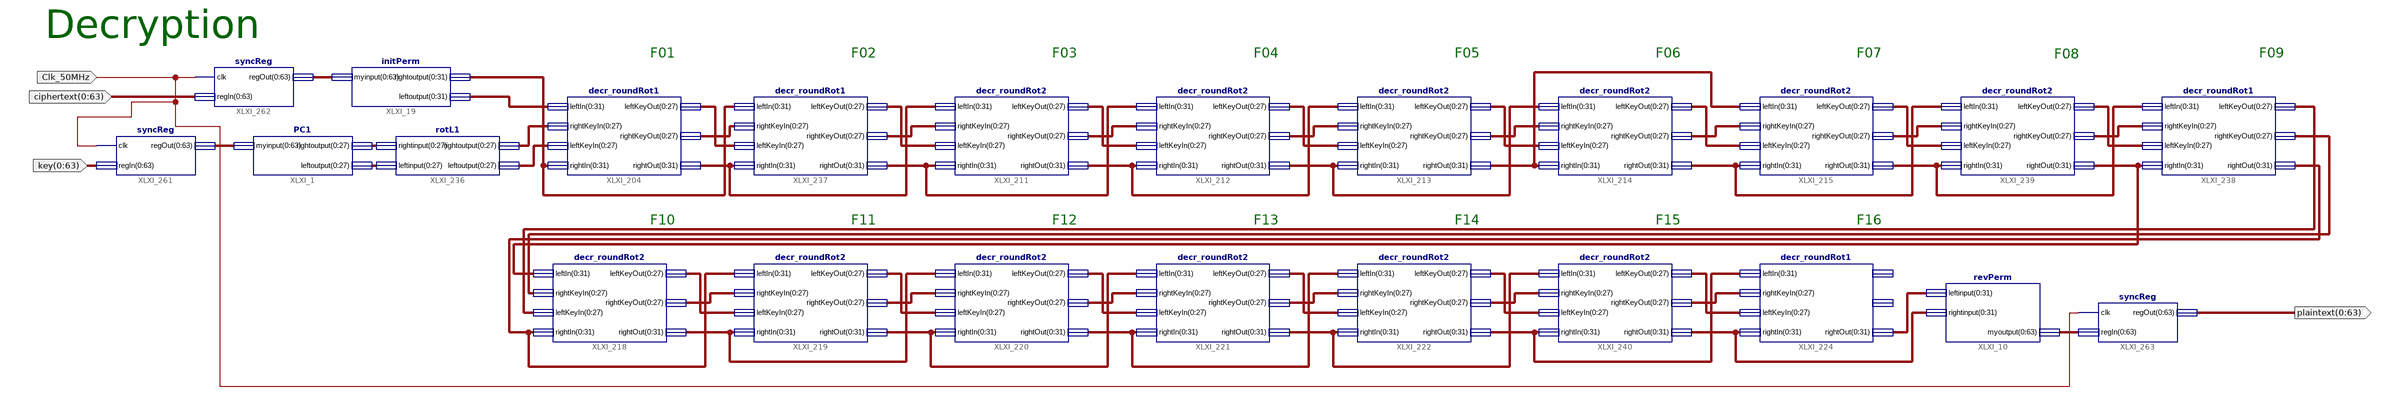
[diagram p0: schematic sheet 1]
// Xilinx ISE schematic decr_schem.sch (spartan3e) as structural Verilog: 23 symbols, 4 ports
module decr_schem (
  input  [0:63] key,
  input  Clk_50MHz,
  input  [0:63] ciphertext,
  output [0:63] plaintext
);

  wire [27:0] XLXN_502, XLXN_503, XLXN_506, XLXN_507, XLXN_509, XLXN_510, XLXN_512, XLXN_513, XLXN_515,
       XLXN_516, XLXN_518, XLXN_519, XLXN_532, XLXN_533, XLXN_536, XLXN_537, XLXN_539, XLXN_540, XLXN_542,
       XLXN_543, XLXN_546, XLXN_547, XLXN_549, XLXN_550, XLXN_554, XLXN_555, XLXN_576, XLXN_577, XLXN_579,
       XLXN_580, XLXN_631, XLXN_632, XLXN_633, XLXN_634;
  wire [31:0] XLXN_497, XLXN_498, XLXN_501, XLXN_505, XLXN_508, XLXN_511, XLXN_514, XLXN_517, XLXN_525,
       XLXN_531, XLXN_535, XLXN_538, XLXN_541, XLXN_545, XLXN_725, XLXN_727, XLXN_736, XLXN_737;
  wire [63:0] XLXN_711, XLXN_713, XLXN_718;

  revPerm XLXI_10 (
    .leftinput({XLXN_725[0], XLXN_725[1], XLXN_725[2], XLXN_725[3], XLXN_725[4], XLXN_725[5], XLXN_725[6], XLXN_725[7], XLXN_725[8], XLXN_725[9], XLXN_725[10], XLXN_725[11], XLXN_725[12], XLXN_725[13], XLXN_725[14], XLXN_725[15], XLXN_725[16], XLXN_725[17], XLXN_725[18], XLXN_725[19], XLXN_725[20], XLXN_725[21], XLXN_725[22], XLXN_725[23], XLXN_725[24], XLXN_725[25], XLXN_725[26], XLXN_725[27], XLXN_725[28], XLXN_725[29], XLXN_725[30], XLXN_725[31]}),
    .rightinput({XLXN_727[0], XLXN_727[1], XLXN_727[2], XLXN_727[3], XLXN_727[4], XLXN_727[5], XLXN_727[6], XLXN_727[7], XLXN_727[8], XLXN_727[9], XLXN_727[10], XLXN_727[11], XLXN_727[12], XLXN_727[13], XLXN_727[14], XLXN_727[15], XLXN_727[16], XLXN_727[17], XLXN_727[18], XLXN_727[19], XLXN_727[20], XLXN_727[21], XLXN_727[22], XLXN_727[23], XLXN_727[24], XLXN_727[25], XLXN_727[26], XLXN_727[27], XLXN_727[28], XLXN_727[29], XLXN_727[30], XLXN_727[31]}),
    .myoutput({XLXN_718[0], XLXN_718[1], XLXN_718[2], XLXN_718[3], XLXN_718[4], XLXN_718[5], XLXN_718[6], XLXN_718[7], XLXN_718[8], XLXN_718[9], XLXN_718[10], XLXN_718[11], XLXN_718[12], XLXN_718[13], XLXN_718[14], XLXN_718[15], XLXN_718[16], XLXN_718[17], XLXN_718[18], XLXN_718[19], XLXN_718[20], XLXN_718[21], XLXN_718[22], XLXN_718[23], XLXN_718[24], XLXN_718[25], XLXN_718[26], XLXN_718[27], XLXN_718[28], XLXN_718[29], XLXN_718[30], XLXN_718[31], XLXN_718[32], XLXN_718[33], XLXN_718[34], XLXN_718[35], XLXN_718[36], XLXN_718[37], XLXN_718[38], XLXN_718[39], XLXN_718[40], XLXN_718[41], XLXN_718[42], XLXN_718[43], XLXN_718[44], XLXN_718[45], XLXN_718[46], XLXN_718[47], XLXN_718[48], XLXN_718[49], XLXN_718[50], XLXN_718[51], XLXN_718[52], XLXN_718[53], XLXN_718[54], XLXN_718[55], XLXN_718[56], XLXN_718[57], XLXN_718[58], XLXN_718[59], XLXN_718[60], XLXN_718[61], XLXN_718[62], XLXN_718[63]}));
  decr_roundRot2 XLXI_211 (
    .leftIn({XLXN_497[0], XLXN_497[1], XLXN_497[2], XLXN_497[3], XLXN_497[4], XLXN_497[5], XLXN_497[6], XLXN_497[7], XLXN_497[8], XLXN_497[9], XLXN_497[10], XLXN_497[11], XLXN_497[12], XLXN_497[13], XLXN_497[14], XLXN_497[15], XLXN_497[16], XLXN_497[17], XLXN_497[18], XLXN_497[19], XLXN_497[20], XLXN_497[21], XLXN_497[22], XLXN_497[23], XLXN_497[24], XLXN_497[25], XLXN_497[26], XLXN_497[27], XLXN_497[28], XLXN_497[29], XLXN_497[30], XLXN_497[31]}),
    .rightKeyIn({XLXN_577[0], XLXN_577[1], XLXN_577[2], XLXN_577[3], XLXN_577[4], XLXN_577[5], XLXN_577[6], XLXN_577[7], XLXN_577[8], XLXN_577[9], XLXN_577[10], XLXN_577[11], XLXN_577[12], XLXN_577[13], XLXN_577[14], XLXN_577[15], XLXN_577[16], XLXN_577[17], XLXN_577[18], XLXN_577[19], XLXN_577[20], XLXN_577[21], XLXN_577[22], XLXN_577[23], XLXN_577[24], XLXN_577[25], XLXN_577[26], XLXN_577[27]}),
    .leftKeyIn({XLXN_576[0], XLXN_576[1], XLXN_576[2], XLXN_576[3], XLXN_576[4], XLXN_576[5], XLXN_576[6], XLXN_576[7], XLXN_576[8], XLXN_576[9], XLXN_576[10], XLXN_576[11], XLXN_576[12], XLXN_576[13], XLXN_576[14], XLXN_576[15], XLXN_576[16], XLXN_576[17], XLXN_576[18], XLXN_576[19], XLXN_576[20], XLXN_576[21], XLXN_576[22], XLXN_576[23], XLXN_576[24], XLXN_576[25], XLXN_576[26], XLXN_576[27]}),
    .rightIn({XLXN_498[0], XLXN_498[1], XLXN_498[2], XLXN_498[3], XLXN_498[4], XLXN_498[5], XLXN_498[6], XLXN_498[7], XLXN_498[8], XLXN_498[9], XLXN_498[10], XLXN_498[11], XLXN_498[12], XLXN_498[13], XLXN_498[14], XLXN_498[15], XLXN_498[16], XLXN_498[17], XLXN_498[18], XLXN_498[19], XLXN_498[20], XLXN_498[21], XLXN_498[22], XLXN_498[23], XLXN_498[24], XLXN_498[25], XLXN_498[26], XLXN_498[27], XLXN_498[28], XLXN_498[29], XLXN_498[30], XLXN_498[31]}),
    .leftKeyOut({XLXN_503[0], XLXN_503[1], XLXN_503[2], XLXN_503[3], XLXN_503[4], XLXN_503[5], XLXN_503[6], XLXN_503[7], XLXN_503[8], XLXN_503[9], XLXN_503[10], XLXN_503[11], XLXN_503[12], XLXN_503[13], XLXN_503[14], XLXN_503[15], XLXN_503[16], XLXN_503[17], XLXN_503[18], XLXN_503[19], XLXN_503[20], XLXN_503[21], XLXN_503[22], XLXN_503[23], XLXN_503[24], XLXN_503[25], XLXN_503[26], XLXN_503[27]}),
    .rightKeyOut({XLXN_502[0], XLXN_502[1], XLXN_502[2], XLXN_502[3], XLXN_502[4], XLXN_502[5], XLXN_502[6], XLXN_502[7], XLXN_502[8], XLXN_502[9], XLXN_502[10], XLXN_502[11], XLXN_502[12], XLXN_502[13], XLXN_502[14], XLXN_502[15], XLXN_502[16], XLXN_502[17], XLXN_502[18], XLXN_502[19], XLXN_502[20], XLXN_502[21], XLXN_502[22], XLXN_502[23], XLXN_502[24], XLXN_502[25], XLXN_502[26], XLXN_502[27]}),
    .rightOut({XLXN_501[0], XLXN_501[1], XLXN_501[2], XLXN_501[3], XLXN_501[4], XLXN_501[5], XLXN_501[6], XLXN_501[7], XLXN_501[8], XLXN_501[9], XLXN_501[10], XLXN_501[11], XLXN_501[12], XLXN_501[13], XLXN_501[14], XLXN_501[15], XLXN_501[16], XLXN_501[17], XLXN_501[18], XLXN_501[19], XLXN_501[20], XLXN_501[21], XLXN_501[22], XLXN_501[23], XLXN_501[24], XLXN_501[25], XLXN_501[26], XLXN_501[27], XLXN_501[28], XLXN_501[29], XLXN_501[30], XLXN_501[31]}));
  decr_roundRot2 XLXI_212 (
    .leftIn({XLXN_498[0], XLXN_498[1], XLXN_498[2], XLXN_498[3], XLXN_498[4], XLXN_498[5], XLXN_498[6], XLXN_498[7], XLXN_498[8], XLXN_498[9], XLXN_498[10], XLXN_498[11], XLXN_498[12], XLXN_498[13], XLXN_498[14], XLXN_498[15], XLXN_498[16], XLXN_498[17], XLXN_498[18], XLXN_498[19], XLXN_498[20], XLXN_498[21], XLXN_498[22], XLXN_498[23], XLXN_498[24], XLXN_498[25], XLXN_498[26], XLXN_498[27], XLXN_498[28], XLXN_498[29], XLXN_498[30], XLXN_498[31]}),
    .rightKeyIn({XLXN_502[0], XLXN_502[1], XLXN_502[2], XLXN_502[3], XLXN_502[4], XLXN_502[5], XLXN_502[6], XLXN_502[7], XLXN_502[8], XLXN_502[9], XLXN_502[10], XLXN_502[11], XLXN_502[12], XLXN_502[13], XLXN_502[14], XLXN_502[15], XLXN_502[16], XLXN_502[17], XLXN_502[18], XLXN_502[19], XLXN_502[20], XLXN_502[21], XLXN_502[22], XLXN_502[23], XLXN_502[24], XLXN_502[25], XLXN_502[26], XLXN_502[27]}),
    .leftKeyIn({XLXN_503[0], XLXN_503[1], XLXN_503[2], XLXN_503[3], XLXN_503[4], XLXN_503[5], XLXN_503[6], XLXN_503[7], XLXN_503[8], XLXN_503[9], XLXN_503[10], XLXN_503[11], XLXN_503[12], XLXN_503[13], XLXN_503[14], XLXN_503[15], XLXN_503[16], XLXN_503[17], XLXN_503[18], XLXN_503[19], XLXN_503[20], XLXN_503[21], XLXN_503[22], XLXN_503[23], XLXN_503[24], XLXN_503[25], XLXN_503[26], XLXN_503[27]}),
    .rightIn({XLXN_501[0], XLXN_501[1], XLXN_501[2], XLXN_501[3], XLXN_501[4], XLXN_501[5], XLXN_501[6], XLXN_501[7], XLXN_501[8], XLXN_501[9], XLXN_501[10], XLXN_501[11], XLXN_501[12], XLXN_501[13], XLXN_501[14], XLXN_501[15], XLXN_501[16], XLXN_501[17], XLXN_501[18], XLXN_501[19], XLXN_501[20], XLXN_501[21], XLXN_501[22], XLXN_501[23], XLXN_501[24], XLXN_501[25], XLXN_501[26], XLXN_501[27], XLXN_501[28], XLXN_501[29], XLXN_501[30], XLXN_501[31]}),
    .leftKeyOut({XLXN_507[0], XLXN_507[1], XLXN_507[2], XLXN_507[3], XLXN_507[4], XLXN_507[5], XLXN_507[6], XLXN_507[7], XLXN_507[8], XLXN_507[9], XLXN_507[10], XLXN_507[11], XLXN_507[12], XLXN_507[13], XLXN_507[14], XLXN_507[15], XLXN_507[16], XLXN_507[17], XLXN_507[18], XLXN_507[19], XLXN_507[20], XLXN_507[21], XLXN_507[22], XLXN_507[23], XLXN_507[24], XLXN_507[25], XLXN_507[26], XLXN_507[27]}),
    .rightKeyOut({XLXN_506[0], XLXN_506[1], XLXN_506[2], XLXN_506[3], XLXN_506[4], XLXN_506[5], XLXN_506[6], XLXN_506[7], XLXN_506[8], XLXN_506[9], XLXN_506[10], XLXN_506[11], XLXN_506[12], XLXN_506[13], XLXN_506[14], XLXN_506[15], XLXN_506[16], XLXN_506[17], XLXN_506[18], XLXN_506[19], XLXN_506[20], XLXN_506[21], XLXN_506[22], XLXN_506[23], XLXN_506[24], XLXN_506[25], XLXN_506[26], XLXN_506[27]}),
    .rightOut({XLXN_505[0], XLXN_505[1], XLXN_505[2], XLXN_505[3], XLXN_505[4], XLXN_505[5], XLXN_505[6], XLXN_505[7], XLXN_505[8], XLXN_505[9], XLXN_505[10], XLXN_505[11], XLXN_505[12], XLXN_505[13], XLXN_505[14], XLXN_505[15], XLXN_505[16], XLXN_505[17], XLXN_505[18], XLXN_505[19], XLXN_505[20], XLXN_505[21], XLXN_505[22], XLXN_505[23], XLXN_505[24], XLXN_505[25], XLXN_505[26], XLXN_505[27], XLXN_505[28], XLXN_505[29], XLXN_505[30], XLXN_505[31]}));
  decr_roundRot2 XLXI_213 (
    .leftIn({XLXN_501[0], XLXN_501[1], XLXN_501[2], XLXN_501[3], XLXN_501[4], XLXN_501[5], XLXN_501[6], XLXN_501[7], XLXN_501[8], XLXN_501[9], XLXN_501[10], XLXN_501[11], XLXN_501[12], XLXN_501[13], XLXN_501[14], XLXN_501[15], XLXN_501[16], XLXN_501[17], XLXN_501[18], XLXN_501[19], XLXN_501[20], XLXN_501[21], XLXN_501[22], XLXN_501[23], XLXN_501[24], XLXN_501[25], XLXN_501[26], XLXN_501[27], XLXN_501[28], XLXN_501[29], XLXN_501[30], XLXN_501[31]}),
    .rightKeyIn({XLXN_506[0], XLXN_506[1], XLXN_506[2], XLXN_506[3], XLXN_506[4], XLXN_506[5], XLXN_506[6], XLXN_506[7], XLXN_506[8], XLXN_506[9], XLXN_506[10], XLXN_506[11], XLXN_506[12], XLXN_506[13], XLXN_506[14], XLXN_506[15], XLXN_506[16], XLXN_506[17], XLXN_506[18], XLXN_506[19], XLXN_506[20], XLXN_506[21], XLXN_506[22], XLXN_506[23], XLXN_506[24], XLXN_506[25], XLXN_506[26], XLXN_506[27]}),
    .leftKeyIn({XLXN_507[0], XLXN_507[1], XLXN_507[2], XLXN_507[3], XLXN_507[4], XLXN_507[5], XLXN_507[6], XLXN_507[7], XLXN_507[8], XLXN_507[9], XLXN_507[10], XLXN_507[11], XLXN_507[12], XLXN_507[13], XLXN_507[14], XLXN_507[15], XLXN_507[16], XLXN_507[17], XLXN_507[18], XLXN_507[19], XLXN_507[20], XLXN_507[21], XLXN_507[22], XLXN_507[23], XLXN_507[24], XLXN_507[25], XLXN_507[26], XLXN_507[27]}),
    .rightIn({XLXN_505[0], XLXN_505[1], XLXN_505[2], XLXN_505[3], XLXN_505[4], XLXN_505[5], XLXN_505[6], XLXN_505[7], XLXN_505[8], XLXN_505[9], XLXN_505[10], XLXN_505[11], XLXN_505[12], XLXN_505[13], XLXN_505[14], XLXN_505[15], XLXN_505[16], XLXN_505[17], XLXN_505[18], XLXN_505[19], XLXN_505[20], XLXN_505[21], XLXN_505[22], XLXN_505[23], XLXN_505[24], XLXN_505[25], XLXN_505[26], XLXN_505[27], XLXN_505[28], XLXN_505[29], XLXN_505[30], XLXN_505[31]}),
    .leftKeyOut({XLXN_510[0], XLXN_510[1], XLXN_510[2], XLXN_510[3], XLXN_510[4], XLXN_510[5], XLXN_510[6], XLXN_510[7], XLXN_510[8], XLXN_510[9], XLXN_510[10], XLXN_510[11], XLXN_510[12], XLXN_510[13], XLXN_510[14], XLXN_510[15], XLXN_510[16], XLXN_510[17], XLXN_510[18], XLXN_510[19], XLXN_510[20], XLXN_510[21], XLXN_510[22], XLXN_510[23], XLXN_510[24], XLXN_510[25], XLXN_510[26], XLXN_510[27]}),
    .rightKeyOut({XLXN_509[0], XLXN_509[1], XLXN_509[2], XLXN_509[3], XLXN_509[4], XLXN_509[5], XLXN_509[6], XLXN_509[7], XLXN_509[8], XLXN_509[9], XLXN_509[10], XLXN_509[11], XLXN_509[12], XLXN_509[13], XLXN_509[14], XLXN_509[15], XLXN_509[16], XLXN_509[17], XLXN_509[18], XLXN_509[19], XLXN_509[20], XLXN_509[21], XLXN_509[22], XLXN_509[23], XLXN_509[24], XLXN_509[25], XLXN_509[26], XLXN_509[27]}),
    .rightOut({XLXN_508[0], XLXN_508[1], XLXN_508[2], XLXN_508[3], XLXN_508[4], XLXN_508[5], XLXN_508[6], XLXN_508[7], XLXN_508[8], XLXN_508[9], XLXN_508[10], XLXN_508[11], XLXN_508[12], XLXN_508[13], XLXN_508[14], XLXN_508[15], XLXN_508[16], XLXN_508[17], XLXN_508[18], XLXN_508[19], XLXN_508[20], XLXN_508[21], XLXN_508[22], XLXN_508[23], XLXN_508[24], XLXN_508[25], XLXN_508[26], XLXN_508[27], XLXN_508[28], XLXN_508[29], XLXN_508[30], XLXN_508[31]}));
  decr_roundRot2 XLXI_214 (
    .leftIn({XLXN_505[0], XLXN_505[1], XLXN_505[2], XLXN_505[3], XLXN_505[4], XLXN_505[5], XLXN_505[6], XLXN_505[7], XLXN_505[8], XLXN_505[9], XLXN_505[10], XLXN_505[11], XLXN_505[12], XLXN_505[13], XLXN_505[14], XLXN_505[15], XLXN_505[16], XLXN_505[17], XLXN_505[18], XLXN_505[19], XLXN_505[20], XLXN_505[21], XLXN_505[22], XLXN_505[23], XLXN_505[24], XLXN_505[25], XLXN_505[26], XLXN_505[27], XLXN_505[28], XLXN_505[29], XLXN_505[30], XLXN_505[31]}),
    .rightKeyIn({XLXN_509[0], XLXN_509[1], XLXN_509[2], XLXN_509[3], XLXN_509[4], XLXN_509[5], XLXN_509[6], XLXN_509[7], XLXN_509[8], XLXN_509[9], XLXN_509[10], XLXN_509[11], XLXN_509[12], XLXN_509[13], XLXN_509[14], XLXN_509[15], XLXN_509[16], XLXN_509[17], XLXN_509[18], XLXN_509[19], XLXN_509[20], XLXN_509[21], XLXN_509[22], XLXN_509[23], XLXN_509[24], XLXN_509[25], XLXN_509[26], XLXN_509[27]}),
    .leftKeyIn({XLXN_510[0], XLXN_510[1], XLXN_510[2], XLXN_510[3], XLXN_510[4], XLXN_510[5], XLXN_510[6], XLXN_510[7], XLXN_510[8], XLXN_510[9], XLXN_510[10], XLXN_510[11], XLXN_510[12], XLXN_510[13], XLXN_510[14], XLXN_510[15], XLXN_510[16], XLXN_510[17], XLXN_510[18], XLXN_510[19], XLXN_510[20], XLXN_510[21], XLXN_510[22], XLXN_510[23], XLXN_510[24], XLXN_510[25], XLXN_510[26], XLXN_510[27]}),
    .rightIn({XLXN_508[0], XLXN_508[1], XLXN_508[2], XLXN_508[3], XLXN_508[4], XLXN_508[5], XLXN_508[6], XLXN_508[7], XLXN_508[8], XLXN_508[9], XLXN_508[10], XLXN_508[11], XLXN_508[12], XLXN_508[13], XLXN_508[14], XLXN_508[15], XLXN_508[16], XLXN_508[17], XLXN_508[18], XLXN_508[19], XLXN_508[20], XLXN_508[21], XLXN_508[22], XLXN_508[23], XLXN_508[24], XLXN_508[25], XLXN_508[26], XLXN_508[27], XLXN_508[28], XLXN_508[29], XLXN_508[30], XLXN_508[31]}),
    .leftKeyOut({XLXN_513[0], XLXN_513[1], XLXN_513[2], XLXN_513[3], XLXN_513[4], XLXN_513[5], XLXN_513[6], XLXN_513[7], XLXN_513[8], XLXN_513[9], XLXN_513[10], XLXN_513[11], XLXN_513[12], XLXN_513[13], XLXN_513[14], XLXN_513[15], XLXN_513[16], XLXN_513[17], XLXN_513[18], XLXN_513[19], XLXN_513[20], XLXN_513[21], XLXN_513[22], XLXN_513[23], XLXN_513[24], XLXN_513[25], XLXN_513[26], XLXN_513[27]}),
    .rightKeyOut({XLXN_512[0], XLXN_512[1], XLXN_512[2], XLXN_512[3], XLXN_512[4], XLXN_512[5], XLXN_512[6], XLXN_512[7], XLXN_512[8], XLXN_512[9], XLXN_512[10], XLXN_512[11], XLXN_512[12], XLXN_512[13], XLXN_512[14], XLXN_512[15], XLXN_512[16], XLXN_512[17], XLXN_512[18], XLXN_512[19], XLXN_512[20], XLXN_512[21], XLXN_512[22], XLXN_512[23], XLXN_512[24], XLXN_512[25], XLXN_512[26], XLXN_512[27]}),
    .rightOut({XLXN_511[0], XLXN_511[1], XLXN_511[2], XLXN_511[3], XLXN_511[4], XLXN_511[5], XLXN_511[6], XLXN_511[7], XLXN_511[8], XLXN_511[9], XLXN_511[10], XLXN_511[11], XLXN_511[12], XLXN_511[13], XLXN_511[14], XLXN_511[15], XLXN_511[16], XLXN_511[17], XLXN_511[18], XLXN_511[19], XLXN_511[20], XLXN_511[21], XLXN_511[22], XLXN_511[23], XLXN_511[24], XLXN_511[25], XLXN_511[26], XLXN_511[27], XLXN_511[28], XLXN_511[29], XLXN_511[30], XLXN_511[31]}));
  decr_roundRot2 XLXI_215 (
    .leftIn({XLXN_508[0], XLXN_508[1], XLXN_508[2], XLXN_508[3], XLXN_508[4], XLXN_508[5], XLXN_508[6], XLXN_508[7], XLXN_508[8], XLXN_508[9], XLXN_508[10], XLXN_508[11], XLXN_508[12], XLXN_508[13], XLXN_508[14], XLXN_508[15], XLXN_508[16], XLXN_508[17], XLXN_508[18], XLXN_508[19], XLXN_508[20], XLXN_508[21], XLXN_508[22], XLXN_508[23], XLXN_508[24], XLXN_508[25], XLXN_508[26], XLXN_508[27], XLXN_508[28], XLXN_508[29], XLXN_508[30], XLXN_508[31]}),
    .rightKeyIn({XLXN_512[0], XLXN_512[1], XLXN_512[2], XLXN_512[3], XLXN_512[4], XLXN_512[5], XLXN_512[6], XLXN_512[7], XLXN_512[8], XLXN_512[9], XLXN_512[10], XLXN_512[11], XLXN_512[12], XLXN_512[13], XLXN_512[14], XLXN_512[15], XLXN_512[16], XLXN_512[17], XLXN_512[18], XLXN_512[19], XLXN_512[20], XLXN_512[21], XLXN_512[22], XLXN_512[23], XLXN_512[24], XLXN_512[25], XLXN_512[26], XLXN_512[27]}),
    .leftKeyIn({XLXN_513[0], XLXN_513[1], XLXN_513[2], XLXN_513[3], XLXN_513[4], XLXN_513[5], XLXN_513[6], XLXN_513[7], XLXN_513[8], XLXN_513[9], XLXN_513[10], XLXN_513[11], XLXN_513[12], XLXN_513[13], XLXN_513[14], XLXN_513[15], XLXN_513[16], XLXN_513[17], XLXN_513[18], XLXN_513[19], XLXN_513[20], XLXN_513[21], XLXN_513[22], XLXN_513[23], XLXN_513[24], XLXN_513[25], XLXN_513[26], XLXN_513[27]}),
    .rightIn({XLXN_511[0], XLXN_511[1], XLXN_511[2], XLXN_511[3], XLXN_511[4], XLXN_511[5], XLXN_511[6], XLXN_511[7], XLXN_511[8], XLXN_511[9], XLXN_511[10], XLXN_511[11], XLXN_511[12], XLXN_511[13], XLXN_511[14], XLXN_511[15], XLXN_511[16], XLXN_511[17], XLXN_511[18], XLXN_511[19], XLXN_511[20], XLXN_511[21], XLXN_511[22], XLXN_511[23], XLXN_511[24], XLXN_511[25], XLXN_511[26], XLXN_511[27], XLXN_511[28], XLXN_511[29], XLXN_511[30], XLXN_511[31]}),
    .leftKeyOut({XLXN_516[0], XLXN_516[1], XLXN_516[2], XLXN_516[3], XLXN_516[4], XLXN_516[5], XLXN_516[6], XLXN_516[7], XLXN_516[8], XLXN_516[9], XLXN_516[10], XLXN_516[11], XLXN_516[12], XLXN_516[13], XLXN_516[14], XLXN_516[15], XLXN_516[16], XLXN_516[17], XLXN_516[18], XLXN_516[19], XLXN_516[20], XLXN_516[21], XLXN_516[22], XLXN_516[23], XLXN_516[24], XLXN_516[25], XLXN_516[26], XLXN_516[27]}),
    .rightKeyOut({XLXN_515[0], XLXN_515[1], XLXN_515[2], XLXN_515[3], XLXN_515[4], XLXN_515[5], XLXN_515[6], XLXN_515[7], XLXN_515[8], XLXN_515[9], XLXN_515[10], XLXN_515[11], XLXN_515[12], XLXN_515[13], XLXN_515[14], XLXN_515[15], XLXN_515[16], XLXN_515[17], XLXN_515[18], XLXN_515[19], XLXN_515[20], XLXN_515[21], XLXN_515[22], XLXN_515[23], XLXN_515[24], XLXN_515[25], XLXN_515[26], XLXN_515[27]}),
    .rightOut({XLXN_514[0], XLXN_514[1], XLXN_514[2], XLXN_514[3], XLXN_514[4], XLXN_514[5], XLXN_514[6], XLXN_514[7], XLXN_514[8], XLXN_514[9], XLXN_514[10], XLXN_514[11], XLXN_514[12], XLXN_514[13], XLXN_514[14], XLXN_514[15], XLXN_514[16], XLXN_514[17], XLXN_514[18], XLXN_514[19], XLXN_514[20], XLXN_514[21], XLXN_514[22], XLXN_514[23], XLXN_514[24], XLXN_514[25], XLXN_514[26], XLXN_514[27], XLXN_514[28], XLXN_514[29], XLXN_514[30], XLXN_514[31]}));
  decr_roundRot2 XLXI_218 (
    .leftIn({XLXN_517[0], XLXN_517[1], XLXN_517[2], XLXN_517[3], XLXN_517[4], XLXN_517[5], XLXN_517[6], XLXN_517[7], XLXN_517[8], XLXN_517[9], XLXN_517[10], XLXN_517[11], XLXN_517[12], XLXN_517[13], XLXN_517[14], XLXN_517[15], XLXN_517[16], XLXN_517[17], XLXN_517[18], XLXN_517[19], XLXN_517[20], XLXN_517[21], XLXN_517[22], XLXN_517[23], XLXN_517[24], XLXN_517[25], XLXN_517[26], XLXN_517[27], XLXN_517[28], XLXN_517[29], XLXN_517[30], XLXN_517[31]}),
    .rightKeyIn({XLXN_579[0], XLXN_579[1], XLXN_579[2], XLXN_579[3], XLXN_579[4], XLXN_579[5], XLXN_579[6], XLXN_579[7], XLXN_579[8], XLXN_579[9], XLXN_579[10], XLXN_579[11], XLXN_579[12], XLXN_579[13], XLXN_579[14], XLXN_579[15], XLXN_579[16], XLXN_579[17], XLXN_579[18], XLXN_579[19], XLXN_579[20], XLXN_579[21], XLXN_579[22], XLXN_579[23], XLXN_579[24], XLXN_579[25], XLXN_579[26], XLXN_579[27]}),
    .leftKeyIn({XLXN_580[0], XLXN_580[1], XLXN_580[2], XLXN_580[3], XLXN_580[4], XLXN_580[5], XLXN_580[6], XLXN_580[7], XLXN_580[8], XLXN_580[9], XLXN_580[10], XLXN_580[11], XLXN_580[12], XLXN_580[13], XLXN_580[14], XLXN_580[15], XLXN_580[16], XLXN_580[17], XLXN_580[18], XLXN_580[19], XLXN_580[20], XLXN_580[21], XLXN_580[22], XLXN_580[23], XLXN_580[24], XLXN_580[25], XLXN_580[26], XLXN_580[27]}),
    .rightIn({XLXN_525[0], XLXN_525[1], XLXN_525[2], XLXN_525[3], XLXN_525[4], XLXN_525[5], XLXN_525[6], XLXN_525[7], XLXN_525[8], XLXN_525[9], XLXN_525[10], XLXN_525[11], XLXN_525[12], XLXN_525[13], XLXN_525[14], XLXN_525[15], XLXN_525[16], XLXN_525[17], XLXN_525[18], XLXN_525[19], XLXN_525[20], XLXN_525[21], XLXN_525[22], XLXN_525[23], XLXN_525[24], XLXN_525[25], XLXN_525[26], XLXN_525[27], XLXN_525[28], XLXN_525[29], XLXN_525[30], XLXN_525[31]}),
    .leftKeyOut({XLXN_533[0], XLXN_533[1], XLXN_533[2], XLXN_533[3], XLXN_533[4], XLXN_533[5], XLXN_533[6], XLXN_533[7], XLXN_533[8], XLXN_533[9], XLXN_533[10], XLXN_533[11], XLXN_533[12], XLXN_533[13], XLXN_533[14], XLXN_533[15], XLXN_533[16], XLXN_533[17], XLXN_533[18], XLXN_533[19], XLXN_533[20], XLXN_533[21], XLXN_533[22], XLXN_533[23], XLXN_533[24], XLXN_533[25], XLXN_533[26], XLXN_533[27]}),
    .rightKeyOut({XLXN_532[0], XLXN_532[1], XLXN_532[2], XLXN_532[3], XLXN_532[4], XLXN_532[5], XLXN_532[6], XLXN_532[7], XLXN_532[8], XLXN_532[9], XLXN_532[10], XLXN_532[11], XLXN_532[12], XLXN_532[13], XLXN_532[14], XLXN_532[15], XLXN_532[16], XLXN_532[17], XLXN_532[18], XLXN_532[19], XLXN_532[20], XLXN_532[21], XLXN_532[22], XLXN_532[23], XLXN_532[24], XLXN_532[25], XLXN_532[26], XLXN_532[27]}),
    .rightOut({XLXN_531[0], XLXN_531[1], XLXN_531[2], XLXN_531[3], XLXN_531[4], XLXN_531[5], XLXN_531[6], XLXN_531[7], XLXN_531[8], XLXN_531[9], XLXN_531[10], XLXN_531[11], XLXN_531[12], XLXN_531[13], XLXN_531[14], XLXN_531[15], XLXN_531[16], XLXN_531[17], XLXN_531[18], XLXN_531[19], XLXN_531[20], XLXN_531[21], XLXN_531[22], XLXN_531[23], XLXN_531[24], XLXN_531[25], XLXN_531[26], XLXN_531[27], XLXN_531[28], XLXN_531[29], XLXN_531[30], XLXN_531[31]}));
  decr_roundRot2 XLXI_219 (
    .leftIn({XLXN_525[0], XLXN_525[1], XLXN_525[2], XLXN_525[3], XLXN_525[4], XLXN_525[5], XLXN_525[6], XLXN_525[7], XLXN_525[8], XLXN_525[9], XLXN_525[10], XLXN_525[11], XLXN_525[12], XLXN_525[13], XLXN_525[14], XLXN_525[15], XLXN_525[16], XLXN_525[17], XLXN_525[18], XLXN_525[19], XLXN_525[20], XLXN_525[21], XLXN_525[22], XLXN_525[23], XLXN_525[24], XLXN_525[25], XLXN_525[26], XLXN_525[27], XLXN_525[28], XLXN_525[29], XLXN_525[30], XLXN_525[31]}),
    .rightKeyIn({XLXN_532[0], XLXN_532[1], XLXN_532[2], XLXN_532[3], XLXN_532[4], XLXN_532[5], XLXN_532[6], XLXN_532[7], XLXN_532[8], XLXN_532[9], XLXN_532[10], XLXN_532[11], XLXN_532[12], XLXN_532[13], XLXN_532[14], XLXN_532[15], XLXN_532[16], XLXN_532[17], XLXN_532[18], XLXN_532[19], XLXN_532[20], XLXN_532[21], XLXN_532[22], XLXN_532[23], XLXN_532[24], XLXN_532[25], XLXN_532[26], XLXN_532[27]}),
    .leftKeyIn({XLXN_533[0], XLXN_533[1], XLXN_533[2], XLXN_533[3], XLXN_533[4], XLXN_533[5], XLXN_533[6], XLXN_533[7], XLXN_533[8], XLXN_533[9], XLXN_533[10], XLXN_533[11], XLXN_533[12], XLXN_533[13], XLXN_533[14], XLXN_533[15], XLXN_533[16], XLXN_533[17], XLXN_533[18], XLXN_533[19], XLXN_533[20], XLXN_533[21], XLXN_533[22], XLXN_533[23], XLXN_533[24], XLXN_533[25], XLXN_533[26], XLXN_533[27]}),
    .rightIn({XLXN_531[0], XLXN_531[1], XLXN_531[2], XLXN_531[3], XLXN_531[4], XLXN_531[5], XLXN_531[6], XLXN_531[7], XLXN_531[8], XLXN_531[9], XLXN_531[10], XLXN_531[11], XLXN_531[12], XLXN_531[13], XLXN_531[14], XLXN_531[15], XLXN_531[16], XLXN_531[17], XLXN_531[18], XLXN_531[19], XLXN_531[20], XLXN_531[21], XLXN_531[22], XLXN_531[23], XLXN_531[24], XLXN_531[25], XLXN_531[26], XLXN_531[27], XLXN_531[28], XLXN_531[29], XLXN_531[30], XLXN_531[31]}),
    .leftKeyOut({XLXN_537[0], XLXN_537[1], XLXN_537[2], XLXN_537[3], XLXN_537[4], XLXN_537[5], XLXN_537[6], XLXN_537[7], XLXN_537[8], XLXN_537[9], XLXN_537[10], XLXN_537[11], XLXN_537[12], XLXN_537[13], XLXN_537[14], XLXN_537[15], XLXN_537[16], XLXN_537[17], XLXN_537[18], XLXN_537[19], XLXN_537[20], XLXN_537[21], XLXN_537[22], XLXN_537[23], XLXN_537[24], XLXN_537[25], XLXN_537[26], XLXN_537[27]}),
    .rightKeyOut({XLXN_536[0], XLXN_536[1], XLXN_536[2], XLXN_536[3], XLXN_536[4], XLXN_536[5], XLXN_536[6], XLXN_536[7], XLXN_536[8], XLXN_536[9], XLXN_536[10], XLXN_536[11], XLXN_536[12], XLXN_536[13], XLXN_536[14], XLXN_536[15], XLXN_536[16], XLXN_536[17], XLXN_536[18], XLXN_536[19], XLXN_536[20], XLXN_536[21], XLXN_536[22], XLXN_536[23], XLXN_536[24], XLXN_536[25], XLXN_536[26], XLXN_536[27]}),
    .rightOut({XLXN_535[0], XLXN_535[1], XLXN_535[2], XLXN_535[3], XLXN_535[4], XLXN_535[5], XLXN_535[6], XLXN_535[7], XLXN_535[8], XLXN_535[9], XLXN_535[10], XLXN_535[11], XLXN_535[12], XLXN_535[13], XLXN_535[14], XLXN_535[15], XLXN_535[16], XLXN_535[17], XLXN_535[18], XLXN_535[19], XLXN_535[20], XLXN_535[21], XLXN_535[22], XLXN_535[23], XLXN_535[24], XLXN_535[25], XLXN_535[26], XLXN_535[27], XLXN_535[28], XLXN_535[29], XLXN_535[30], XLXN_535[31]}));
  decr_roundRot2 XLXI_220 (
    .leftIn({XLXN_531[0], XLXN_531[1], XLXN_531[2], XLXN_531[3], XLXN_531[4], XLXN_531[5], XLXN_531[6], XLXN_531[7], XLXN_531[8], XLXN_531[9], XLXN_531[10], XLXN_531[11], XLXN_531[12], XLXN_531[13], XLXN_531[14], XLXN_531[15], XLXN_531[16], XLXN_531[17], XLXN_531[18], XLXN_531[19], XLXN_531[20], XLXN_531[21], XLXN_531[22], XLXN_531[23], XLXN_531[24], XLXN_531[25], XLXN_531[26], XLXN_531[27], XLXN_531[28], XLXN_531[29], XLXN_531[30], XLXN_531[31]}),
    .rightKeyIn({XLXN_536[0], XLXN_536[1], XLXN_536[2], XLXN_536[3], XLXN_536[4], XLXN_536[5], XLXN_536[6], XLXN_536[7], XLXN_536[8], XLXN_536[9], XLXN_536[10], XLXN_536[11], XLXN_536[12], XLXN_536[13], XLXN_536[14], XLXN_536[15], XLXN_536[16], XLXN_536[17], XLXN_536[18], XLXN_536[19], XLXN_536[20], XLXN_536[21], XLXN_536[22], XLXN_536[23], XLXN_536[24], XLXN_536[25], XLXN_536[26], XLXN_536[27]}),
    .leftKeyIn({XLXN_537[0], XLXN_537[1], XLXN_537[2], XLXN_537[3], XLXN_537[4], XLXN_537[5], XLXN_537[6], XLXN_537[7], XLXN_537[8], XLXN_537[9], XLXN_537[10], XLXN_537[11], XLXN_537[12], XLXN_537[13], XLXN_537[14], XLXN_537[15], XLXN_537[16], XLXN_537[17], XLXN_537[18], XLXN_537[19], XLXN_537[20], XLXN_537[21], XLXN_537[22], XLXN_537[23], XLXN_537[24], XLXN_537[25], XLXN_537[26], XLXN_537[27]}),
    .rightIn({XLXN_535[0], XLXN_535[1], XLXN_535[2], XLXN_535[3], XLXN_535[4], XLXN_535[5], XLXN_535[6], XLXN_535[7], XLXN_535[8], XLXN_535[9], XLXN_535[10], XLXN_535[11], XLXN_535[12], XLXN_535[13], XLXN_535[14], XLXN_535[15], XLXN_535[16], XLXN_535[17], XLXN_535[18], XLXN_535[19], XLXN_535[20], XLXN_535[21], XLXN_535[22], XLXN_535[23], XLXN_535[24], XLXN_535[25], XLXN_535[26], XLXN_535[27], XLXN_535[28], XLXN_535[29], XLXN_535[30], XLXN_535[31]}),
    .leftKeyOut({XLXN_540[0], XLXN_540[1], XLXN_540[2], XLXN_540[3], XLXN_540[4], XLXN_540[5], XLXN_540[6], XLXN_540[7], XLXN_540[8], XLXN_540[9], XLXN_540[10], XLXN_540[11], XLXN_540[12], XLXN_540[13], XLXN_540[14], XLXN_540[15], XLXN_540[16], XLXN_540[17], XLXN_540[18], XLXN_540[19], XLXN_540[20], XLXN_540[21], XLXN_540[22], XLXN_540[23], XLXN_540[24], XLXN_540[25], XLXN_540[26], XLXN_540[27]}),
    .rightKeyOut({XLXN_539[0], XLXN_539[1], XLXN_539[2], XLXN_539[3], XLXN_539[4], XLXN_539[5], XLXN_539[6], XLXN_539[7], XLXN_539[8], XLXN_539[9], XLXN_539[10], XLXN_539[11], XLXN_539[12], XLXN_539[13], XLXN_539[14], XLXN_539[15], XLXN_539[16], XLXN_539[17], XLXN_539[18], XLXN_539[19], XLXN_539[20], XLXN_539[21], XLXN_539[22], XLXN_539[23], XLXN_539[24], XLXN_539[25], XLXN_539[26], XLXN_539[27]}),
    .rightOut({XLXN_538[0], XLXN_538[1], XLXN_538[2], XLXN_538[3], XLXN_538[4], XLXN_538[5], XLXN_538[6], XLXN_538[7], XLXN_538[8], XLXN_538[9], XLXN_538[10], XLXN_538[11], XLXN_538[12], XLXN_538[13], XLXN_538[14], XLXN_538[15], XLXN_538[16], XLXN_538[17], XLXN_538[18], XLXN_538[19], XLXN_538[20], XLXN_538[21], XLXN_538[22], XLXN_538[23], XLXN_538[24], XLXN_538[25], XLXN_538[26], XLXN_538[27], XLXN_538[28], XLXN_538[29], XLXN_538[30], XLXN_538[31]}));
  decr_roundRot2 XLXI_222 (
    .leftIn({XLXN_538[0], XLXN_538[1], XLXN_538[2], XLXN_538[3], XLXN_538[4], XLXN_538[5], XLXN_538[6], XLXN_538[7], XLXN_538[8], XLXN_538[9], XLXN_538[10], XLXN_538[11], XLXN_538[12], XLXN_538[13], XLXN_538[14], XLXN_538[15], XLXN_538[16], XLXN_538[17], XLXN_538[18], XLXN_538[19], XLXN_538[20], XLXN_538[21], XLXN_538[22], XLXN_538[23], XLXN_538[24], XLXN_538[25], XLXN_538[26], XLXN_538[27], XLXN_538[28], XLXN_538[29], XLXN_538[30], XLXN_538[31]}),
    .rightKeyIn({XLXN_542[0], XLXN_542[1], XLXN_542[2], XLXN_542[3], XLXN_542[4], XLXN_542[5], XLXN_542[6], XLXN_542[7], XLXN_542[8], XLXN_542[9], XLXN_542[10], XLXN_542[11], XLXN_542[12], XLXN_542[13], XLXN_542[14], XLXN_542[15], XLXN_542[16], XLXN_542[17], XLXN_542[18], XLXN_542[19], XLXN_542[20], XLXN_542[21], XLXN_542[22], XLXN_542[23], XLXN_542[24], XLXN_542[25], XLXN_542[26], XLXN_542[27]}),
    .leftKeyIn({XLXN_543[0], XLXN_543[1], XLXN_543[2], XLXN_543[3], XLXN_543[4], XLXN_543[5], XLXN_543[6], XLXN_543[7], XLXN_543[8], XLXN_543[9], XLXN_543[10], XLXN_543[11], XLXN_543[12], XLXN_543[13], XLXN_543[14], XLXN_543[15], XLXN_543[16], XLXN_543[17], XLXN_543[18], XLXN_543[19], XLXN_543[20], XLXN_543[21], XLXN_543[22], XLXN_543[23], XLXN_543[24], XLXN_543[25], XLXN_543[26], XLXN_543[27]}),
    .rightIn({XLXN_541[0], XLXN_541[1], XLXN_541[2], XLXN_541[3], XLXN_541[4], XLXN_541[5], XLXN_541[6], XLXN_541[7], XLXN_541[8], XLXN_541[9], XLXN_541[10], XLXN_541[11], XLXN_541[12], XLXN_541[13], XLXN_541[14], XLXN_541[15], XLXN_541[16], XLXN_541[17], XLXN_541[18], XLXN_541[19], XLXN_541[20], XLXN_541[21], XLXN_541[22], XLXN_541[23], XLXN_541[24], XLXN_541[25], XLXN_541[26], XLXN_541[27], XLXN_541[28], XLXN_541[29], XLXN_541[30], XLXN_541[31]}),
    .leftKeyOut({XLXN_547[0], XLXN_547[1], XLXN_547[2], XLXN_547[3], XLXN_547[4], XLXN_547[5], XLXN_547[6], XLXN_547[7], XLXN_547[8], XLXN_547[9], XLXN_547[10], XLXN_547[11], XLXN_547[12], XLXN_547[13], XLXN_547[14], XLXN_547[15], XLXN_547[16], XLXN_547[17], XLXN_547[18], XLXN_547[19], XLXN_547[20], XLXN_547[21], XLXN_547[22], XLXN_547[23], XLXN_547[24], XLXN_547[25], XLXN_547[26], XLXN_547[27]}),
    .rightKeyOut({XLXN_546[0], XLXN_546[1], XLXN_546[2], XLXN_546[3], XLXN_546[4], XLXN_546[5], XLXN_546[6], XLXN_546[7], XLXN_546[8], XLXN_546[9], XLXN_546[10], XLXN_546[11], XLXN_546[12], XLXN_546[13], XLXN_546[14], XLXN_546[15], XLXN_546[16], XLXN_546[17], XLXN_546[18], XLXN_546[19], XLXN_546[20], XLXN_546[21], XLXN_546[22], XLXN_546[23], XLXN_546[24], XLXN_546[25], XLXN_546[26], XLXN_546[27]}),
    .rightOut({XLXN_545[0], XLXN_545[1], XLXN_545[2], XLXN_545[3], XLXN_545[4], XLXN_545[5], XLXN_545[6], XLXN_545[7], XLXN_545[8], XLXN_545[9], XLXN_545[10], XLXN_545[11], XLXN_545[12], XLXN_545[13], XLXN_545[14], XLXN_545[15], XLXN_545[16], XLXN_545[17], XLXN_545[18], XLXN_545[19], XLXN_545[20], XLXN_545[21], XLXN_545[22], XLXN_545[23], XLXN_545[24], XLXN_545[25], XLXN_545[26], XLXN_545[27], XLXN_545[28], XLXN_545[29], XLXN_545[30], XLXN_545[31]}));
  decr_roundRot1 XLXI_224 (
    .leftIn({XLXN_545[0], XLXN_545[1], XLXN_545[2], XLXN_545[3], XLXN_545[4], XLXN_545[5], XLXN_545[6], XLXN_545[7], XLXN_545[8], XLXN_545[9], XLXN_545[10], XLXN_545[11], XLXN_545[12], XLXN_545[13], XLXN_545[14], XLXN_545[15], XLXN_545[16], XLXN_545[17], XLXN_545[18], XLXN_545[19], XLXN_545[20], XLXN_545[21], XLXN_545[22], XLXN_545[23], XLXN_545[24], XLXN_545[25], XLXN_545[26], XLXN_545[27], XLXN_545[28], XLXN_545[29], XLXN_545[30], XLXN_545[31]}),
    .rightKeyIn({XLXN_549[0], XLXN_549[1], XLXN_549[2], XLXN_549[3], XLXN_549[4], XLXN_549[5], XLXN_549[6], XLXN_549[7], XLXN_549[8], XLXN_549[9], XLXN_549[10], XLXN_549[11], XLXN_549[12], XLXN_549[13], XLXN_549[14], XLXN_549[15], XLXN_549[16], XLXN_549[17], XLXN_549[18], XLXN_549[19], XLXN_549[20], XLXN_549[21], XLXN_549[22], XLXN_549[23], XLXN_549[24], XLXN_549[25], XLXN_549[26], XLXN_549[27]}),
    .leftKeyIn({XLXN_550[0], XLXN_550[1], XLXN_550[2], XLXN_550[3], XLXN_550[4], XLXN_550[5], XLXN_550[6], XLXN_550[7], XLXN_550[8], XLXN_550[9], XLXN_550[10], XLXN_550[11], XLXN_550[12], XLXN_550[13], XLXN_550[14], XLXN_550[15], XLXN_550[16], XLXN_550[17], XLXN_550[18], XLXN_550[19], XLXN_550[20], XLXN_550[21], XLXN_550[22], XLXN_550[23], XLXN_550[24], XLXN_550[25], XLXN_550[26], XLXN_550[27]}),
    .rightIn({XLXN_727[0], XLXN_727[1], XLXN_727[2], XLXN_727[3], XLXN_727[4], XLXN_727[5], XLXN_727[6], XLXN_727[7], XLXN_727[8], XLXN_727[9], XLXN_727[10], XLXN_727[11], XLXN_727[12], XLXN_727[13], XLXN_727[14], XLXN_727[15], XLXN_727[16], XLXN_727[17], XLXN_727[18], XLXN_727[19], XLXN_727[20], XLXN_727[21], XLXN_727[22], XLXN_727[23], XLXN_727[24], XLXN_727[25], XLXN_727[26], XLXN_727[27], XLXN_727[28], XLXN_727[29], XLXN_727[30], XLXN_727[31]}),
    .rightOut({XLXN_725[0], XLXN_725[1], XLXN_725[2], XLXN_725[3], XLXN_725[4], XLXN_725[5], XLXN_725[6], XLXN_725[7], XLXN_725[8], XLXN_725[9], XLXN_725[10], XLXN_725[11], XLXN_725[12], XLXN_725[13], XLXN_725[14], XLXN_725[15], XLXN_725[16], XLXN_725[17], XLXN_725[18], XLXN_725[19], XLXN_725[20], XLXN_725[21], XLXN_725[22], XLXN_725[23], XLXN_725[24], XLXN_725[25], XLXN_725[26], XLXN_725[27], XLXN_725[28], XLXN_725[29], XLXN_725[30], XLXN_725[31]}));  // open: leftKeyOut, rightKeyOut
  PC1 XLXI_1 (
    .myinput({XLXN_711[0], XLXN_711[1], XLXN_711[2], XLXN_711[3], XLXN_711[4], XLXN_711[5], XLXN_711[6], XLXN_711[7], XLXN_711[8], XLXN_711[9], XLXN_711[10], XLXN_711[11], XLXN_711[12], XLXN_711[13], XLXN_711[14], XLXN_711[15], XLXN_711[16], XLXN_711[17], XLXN_711[18], XLXN_711[19], XLXN_711[20], XLXN_711[21], XLXN_711[22], XLXN_711[23], XLXN_711[24], XLXN_711[25], XLXN_711[26], XLXN_711[27], XLXN_711[28], XLXN_711[29], XLXN_711[30], XLXN_711[31], XLXN_711[32], XLXN_711[33], XLXN_711[34], XLXN_711[35], XLXN_711[36], XLXN_711[37], XLXN_711[38], XLXN_711[39], XLXN_711[40], XLXN_711[41], XLXN_711[42], XLXN_711[43], XLXN_711[44], XLXN_711[45], XLXN_711[46], XLXN_711[47], XLXN_711[48], XLXN_711[49], XLXN_711[50], XLXN_711[51], XLXN_711[52], XLXN_711[53], XLXN_711[54], XLXN_711[55], XLXN_711[56], XLXN_711[57], XLXN_711[58], XLXN_711[59], XLXN_711[60], XLXN_711[61], XLXN_711[62], XLXN_711[63]}),
    .rightoutput({XLXN_631[0], XLXN_631[1], XLXN_631[2], XLXN_631[3], XLXN_631[4], XLXN_631[5], XLXN_631[6], XLXN_631[7], XLXN_631[8], XLXN_631[9], XLXN_631[10], XLXN_631[11], XLXN_631[12], XLXN_631[13], XLXN_631[14], XLXN_631[15], XLXN_631[16], XLXN_631[17], XLXN_631[18], XLXN_631[19], XLXN_631[20], XLXN_631[21], XLXN_631[22], XLXN_631[23], XLXN_631[24], XLXN_631[25], XLXN_631[26], XLXN_631[27]}),
    .leftoutput({XLXN_632[0], XLXN_632[1], XLXN_632[2], XLXN_632[3], XLXN_632[4], XLXN_632[5], XLXN_632[6], XLXN_632[7], XLXN_632[8], XLXN_632[9], XLXN_632[10], XLXN_632[11], XLXN_632[12], XLXN_632[13], XLXN_632[14], XLXN_632[15], XLXN_632[16], XLXN_632[17], XLXN_632[18], XLXN_632[19], XLXN_632[20], XLXN_632[21], XLXN_632[22], XLXN_632[23], XLXN_632[24], XLXN_632[25], XLXN_632[26], XLXN_632[27]}));
  initPerm XLXI_19 (
    .myinput({XLXN_713[0], XLXN_713[1], XLXN_713[2], XLXN_713[3], XLXN_713[4], XLXN_713[5], XLXN_713[6], XLXN_713[7], XLXN_713[8], XLXN_713[9], XLXN_713[10], XLXN_713[11], XLXN_713[12], XLXN_713[13], XLXN_713[14], XLXN_713[15], XLXN_713[16], XLXN_713[17], XLXN_713[18], XLXN_713[19], XLXN_713[20], XLXN_713[21], XLXN_713[22], XLXN_713[23], XLXN_713[24], XLXN_713[25], XLXN_713[26], XLXN_713[27], XLXN_713[28], XLXN_713[29], XLXN_713[30], XLXN_713[31], XLXN_713[32], XLXN_713[33], XLXN_713[34], XLXN_713[35], XLXN_713[36], XLXN_713[37], XLXN_713[38], XLXN_713[39], XLXN_713[40], XLXN_713[41], XLXN_713[42], XLXN_713[43], XLXN_713[44], XLXN_713[45], XLXN_713[46], XLXN_713[47], XLXN_713[48], XLXN_713[49], XLXN_713[50], XLXN_713[51], XLXN_713[52], XLXN_713[53], XLXN_713[54], XLXN_713[55], XLXN_713[56], XLXN_713[57], XLXN_713[58], XLXN_713[59], XLXN_713[60], XLXN_713[61], XLXN_713[62], XLXN_713[63]}),
    .rightoutput({XLXN_736[0], XLXN_736[1], XLXN_736[2], XLXN_736[3], XLXN_736[4], XLXN_736[5], XLXN_736[6], XLXN_736[7], XLXN_736[8], XLXN_736[9], XLXN_736[10], XLXN_736[11], XLXN_736[12], XLXN_736[13], XLXN_736[14], XLXN_736[15], XLXN_736[16], XLXN_736[17], XLXN_736[18], XLXN_736[19], XLXN_736[20], XLXN_736[21], XLXN_736[22], XLXN_736[23], XLXN_736[24], XLXN_736[25], XLXN_736[26], XLXN_736[27], XLXN_736[28], XLXN_736[29], XLXN_736[30], XLXN_736[31]}),
    .leftoutput({XLXN_737[0], XLXN_737[1], XLXN_737[2], XLXN_737[3], XLXN_737[4], XLXN_737[5], XLXN_737[6], XLXN_737[7], XLXN_737[8], XLXN_737[9], XLXN_737[10], XLXN_737[11], XLXN_737[12], XLXN_737[13], XLXN_737[14], XLXN_737[15], XLXN_737[16], XLXN_737[17], XLXN_737[18], XLXN_737[19], XLXN_737[20], XLXN_737[21], XLXN_737[22], XLXN_737[23], XLXN_737[24], XLXN_737[25], XLXN_737[26], XLXN_737[27], XLXN_737[28], XLXN_737[29], XLXN_737[30], XLXN_737[31]}));
  decr_roundRot1 XLXI_204 (
    .leftIn({XLXN_737[0], XLXN_737[1], XLXN_737[2], XLXN_737[3], XLXN_737[4], XLXN_737[5], XLXN_737[6], XLXN_737[7], XLXN_737[8], XLXN_737[9], XLXN_737[10], XLXN_737[11], XLXN_737[12], XLXN_737[13], XLXN_737[14], XLXN_737[15], XLXN_737[16], XLXN_737[17], XLXN_737[18], XLXN_737[19], XLXN_737[20], XLXN_737[21], XLXN_737[22], XLXN_737[23], XLXN_737[24], XLXN_737[25], XLXN_737[26], XLXN_737[27], XLXN_737[28], XLXN_737[29], XLXN_737[30], XLXN_737[31]}),
    .rightKeyIn({XLXN_634[0], XLXN_634[1], XLXN_634[2], XLXN_634[3], XLXN_634[4], XLXN_634[5], XLXN_634[6], XLXN_634[7], XLXN_634[8], XLXN_634[9], XLXN_634[10], XLXN_634[11], XLXN_634[12], XLXN_634[13], XLXN_634[14], XLXN_634[15], XLXN_634[16], XLXN_634[17], XLXN_634[18], XLXN_634[19], XLXN_634[20], XLXN_634[21], XLXN_634[22], XLXN_634[23], XLXN_634[24], XLXN_634[25], XLXN_634[26], XLXN_634[27]}),
    .leftKeyIn({XLXN_633[0], XLXN_633[1], XLXN_633[2], XLXN_633[3], XLXN_633[4], XLXN_633[5], XLXN_633[6], XLXN_633[7], XLXN_633[8], XLXN_633[9], XLXN_633[10], XLXN_633[11], XLXN_633[12], XLXN_633[13], XLXN_633[14], XLXN_633[15], XLXN_633[16], XLXN_633[17], XLXN_633[18], XLXN_633[19], XLXN_633[20], XLXN_633[21], XLXN_633[22], XLXN_633[23], XLXN_633[24], XLXN_633[25], XLXN_633[26], XLXN_633[27]}),
    .rightIn({XLXN_736[0], XLXN_736[1], XLXN_736[2], XLXN_736[3], XLXN_736[4], XLXN_736[5], XLXN_736[6], XLXN_736[7], XLXN_736[8], XLXN_736[9], XLXN_736[10], XLXN_736[11], XLXN_736[12], XLXN_736[13], XLXN_736[14], XLXN_736[15], XLXN_736[16], XLXN_736[17], XLXN_736[18], XLXN_736[19], XLXN_736[20], XLXN_736[21], XLXN_736[22], XLXN_736[23], XLXN_736[24], XLXN_736[25], XLXN_736[26], XLXN_736[27], XLXN_736[28], XLXN_736[29], XLXN_736[30], XLXN_736[31]}),
    .leftKeyOut({XLXN_554[0], XLXN_554[1], XLXN_554[2], XLXN_554[3], XLXN_554[4], XLXN_554[5], XLXN_554[6], XLXN_554[7], XLXN_554[8], XLXN_554[9], XLXN_554[10], XLXN_554[11], XLXN_554[12], XLXN_554[13], XLXN_554[14], XLXN_554[15], XLXN_554[16], XLXN_554[17], XLXN_554[18], XLXN_554[19], XLXN_554[20], XLXN_554[21], XLXN_554[22], XLXN_554[23], XLXN_554[24], XLXN_554[25], XLXN_554[26], XLXN_554[27]}),
    .rightKeyOut({XLXN_555[0], XLXN_555[1], XLXN_555[2], XLXN_555[3], XLXN_555[4], XLXN_555[5], XLXN_555[6], XLXN_555[7], XLXN_555[8], XLXN_555[9], XLXN_555[10], XLXN_555[11], XLXN_555[12], XLXN_555[13], XLXN_555[14], XLXN_555[15], XLXN_555[16], XLXN_555[17], XLXN_555[18], XLXN_555[19], XLXN_555[20], XLXN_555[21], XLXN_555[22], XLXN_555[23], XLXN_555[24], XLXN_555[25], XLXN_555[26], XLXN_555[27]}),
    .rightOut({XLXN_497[0], XLXN_497[1], XLXN_497[2], XLXN_497[3], XLXN_497[4], XLXN_497[5], XLXN_497[6], XLXN_497[7], XLXN_497[8], XLXN_497[9], XLXN_497[10], XLXN_497[11], XLXN_497[12], XLXN_497[13], XLXN_497[14], XLXN_497[15], XLXN_497[16], XLXN_497[17], XLXN_497[18], XLXN_497[19], XLXN_497[20], XLXN_497[21], XLXN_497[22], XLXN_497[23], XLXN_497[24], XLXN_497[25], XLXN_497[26], XLXN_497[27], XLXN_497[28], XLXN_497[29], XLXN_497[30], XLXN_497[31]}));
  rotL1 XLXI_236 (
    .rightinput({XLXN_631[0], XLXN_631[1], XLXN_631[2], XLXN_631[3], XLXN_631[4], XLXN_631[5], XLXN_631[6], XLXN_631[7], XLXN_631[8], XLXN_631[9], XLXN_631[10], XLXN_631[11], XLXN_631[12], XLXN_631[13], XLXN_631[14], XLXN_631[15], XLXN_631[16], XLXN_631[17], XLXN_631[18], XLXN_631[19], XLXN_631[20], XLXN_631[21], XLXN_631[22], XLXN_631[23], XLXN_631[24], XLXN_631[25], XLXN_631[26], XLXN_631[27]}),
    .leftinput({XLXN_632[0], XLXN_632[1], XLXN_632[2], XLXN_632[3], XLXN_632[4], XLXN_632[5], XLXN_632[6], XLXN_632[7], XLXN_632[8], XLXN_632[9], XLXN_632[10], XLXN_632[11], XLXN_632[12], XLXN_632[13], XLXN_632[14], XLXN_632[15], XLXN_632[16], XLXN_632[17], XLXN_632[18], XLXN_632[19], XLXN_632[20], XLXN_632[21], XLXN_632[22], XLXN_632[23], XLXN_632[24], XLXN_632[25], XLXN_632[26], XLXN_632[27]}),
    .rightoutput({XLXN_634[0], XLXN_634[1], XLXN_634[2], XLXN_634[3], XLXN_634[4], XLXN_634[5], XLXN_634[6], XLXN_634[7], XLXN_634[8], XLXN_634[9], XLXN_634[10], XLXN_634[11], XLXN_634[12], XLXN_634[13], XLXN_634[14], XLXN_634[15], XLXN_634[16], XLXN_634[17], XLXN_634[18], XLXN_634[19], XLXN_634[20], XLXN_634[21], XLXN_634[22], XLXN_634[23], XLXN_634[24], XLXN_634[25], XLXN_634[26], XLXN_634[27]}),
    .leftoutput({XLXN_633[0], XLXN_633[1], XLXN_633[2], XLXN_633[3], XLXN_633[4], XLXN_633[5], XLXN_633[6], XLXN_633[7], XLXN_633[8], XLXN_633[9], XLXN_633[10], XLXN_633[11], XLXN_633[12], XLXN_633[13], XLXN_633[14], XLXN_633[15], XLXN_633[16], XLXN_633[17], XLXN_633[18], XLXN_633[19], XLXN_633[20], XLXN_633[21], XLXN_633[22], XLXN_633[23], XLXN_633[24], XLXN_633[25], XLXN_633[26], XLXN_633[27]}));
  decr_roundRot1 XLXI_237 (
    .leftIn({XLXN_736[0], XLXN_736[1], XLXN_736[2], XLXN_736[3], XLXN_736[4], XLXN_736[5], XLXN_736[6], XLXN_736[7], XLXN_736[8], XLXN_736[9], XLXN_736[10], XLXN_736[11], XLXN_736[12], XLXN_736[13], XLXN_736[14], XLXN_736[15], XLXN_736[16], XLXN_736[17], XLXN_736[18], XLXN_736[19], XLXN_736[20], XLXN_736[21], XLXN_736[22], XLXN_736[23], XLXN_736[24], XLXN_736[25], XLXN_736[26], XLXN_736[27], XLXN_736[28], XLXN_736[29], XLXN_736[30], XLXN_736[31]}),
    .rightKeyIn({XLXN_555[0], XLXN_555[1], XLXN_555[2], XLXN_555[3], XLXN_555[4], XLXN_555[5], XLXN_555[6], XLXN_555[7], XLXN_555[8], XLXN_555[9], XLXN_555[10], XLXN_555[11], XLXN_555[12], XLXN_555[13], XLXN_555[14], XLXN_555[15], XLXN_555[16], XLXN_555[17], XLXN_555[18], XLXN_555[19], XLXN_555[20], XLXN_555[21], XLXN_555[22], XLXN_555[23], XLXN_555[24], XLXN_555[25], XLXN_555[26], XLXN_555[27]}),
    .leftKeyIn({XLXN_554[0], XLXN_554[1], XLXN_554[2], XLXN_554[3], XLXN_554[4], XLXN_554[5], XLXN_554[6], XLXN_554[7], XLXN_554[8], XLXN_554[9], XLXN_554[10], XLXN_554[11], XLXN_554[12], XLXN_554[13], XLXN_554[14], XLXN_554[15], XLXN_554[16], XLXN_554[17], XLXN_554[18], XLXN_554[19], XLXN_554[20], XLXN_554[21], XLXN_554[22], XLXN_554[23], XLXN_554[24], XLXN_554[25], XLXN_554[26], XLXN_554[27]}),
    .rightIn({XLXN_497[0], XLXN_497[1], XLXN_497[2], XLXN_497[3], XLXN_497[4], XLXN_497[5], XLXN_497[6], XLXN_497[7], XLXN_497[8], XLXN_497[9], XLXN_497[10], XLXN_497[11], XLXN_497[12], XLXN_497[13], XLXN_497[14], XLXN_497[15], XLXN_497[16], XLXN_497[17], XLXN_497[18], XLXN_497[19], XLXN_497[20], XLXN_497[21], XLXN_497[22], XLXN_497[23], XLXN_497[24], XLXN_497[25], XLXN_497[26], XLXN_497[27], XLXN_497[28], XLXN_497[29], XLXN_497[30], XLXN_497[31]}),
    .leftKeyOut({XLXN_576[0], XLXN_576[1], XLXN_576[2], XLXN_576[3], XLXN_576[4], XLXN_576[5], XLXN_576[6], XLXN_576[7], XLXN_576[8], XLXN_576[9], XLXN_576[10], XLXN_576[11], XLXN_576[12], XLXN_576[13], XLXN_576[14], XLXN_576[15], XLXN_576[16], XLXN_576[17], XLXN_576[18], XLXN_576[19], XLXN_576[20], XLXN_576[21], XLXN_576[22], XLXN_576[23], XLXN_576[24], XLXN_576[25], XLXN_576[26], XLXN_576[27]}),
    .rightKeyOut({XLXN_577[0], XLXN_577[1], XLXN_577[2], XLXN_577[3], XLXN_577[4], XLXN_577[5], XLXN_577[6], XLXN_577[7], XLXN_577[8], XLXN_577[9], XLXN_577[10], XLXN_577[11], XLXN_577[12], XLXN_577[13], XLXN_577[14], XLXN_577[15], XLXN_577[16], XLXN_577[17], XLXN_577[18], XLXN_577[19], XLXN_577[20], XLXN_577[21], XLXN_577[22], XLXN_577[23], XLXN_577[24], XLXN_577[25], XLXN_577[26], XLXN_577[27]}),
    .rightOut({XLXN_498[0], XLXN_498[1], XLXN_498[2], XLXN_498[3], XLXN_498[4], XLXN_498[5], XLXN_498[6], XLXN_498[7], XLXN_498[8], XLXN_498[9], XLXN_498[10], XLXN_498[11], XLXN_498[12], XLXN_498[13], XLXN_498[14], XLXN_498[15], XLXN_498[16], XLXN_498[17], XLXN_498[18], XLXN_498[19], XLXN_498[20], XLXN_498[21], XLXN_498[22], XLXN_498[23], XLXN_498[24], XLXN_498[25], XLXN_498[26], XLXN_498[27], XLXN_498[28], XLXN_498[29], XLXN_498[30], XLXN_498[31]}));
  decr_roundRot1 XLXI_238 (
    .leftIn({XLXN_514[0], XLXN_514[1], XLXN_514[2], XLXN_514[3], XLXN_514[4], XLXN_514[5], XLXN_514[6], XLXN_514[7], XLXN_514[8], XLXN_514[9], XLXN_514[10], XLXN_514[11], XLXN_514[12], XLXN_514[13], XLXN_514[14], XLXN_514[15], XLXN_514[16], XLXN_514[17], XLXN_514[18], XLXN_514[19], XLXN_514[20], XLXN_514[21], XLXN_514[22], XLXN_514[23], XLXN_514[24], XLXN_514[25], XLXN_514[26], XLXN_514[27], XLXN_514[28], XLXN_514[29], XLXN_514[30], XLXN_514[31]}),
    .rightKeyIn({XLXN_518[0], XLXN_518[1], XLXN_518[2], XLXN_518[3], XLXN_518[4], XLXN_518[5], XLXN_518[6], XLXN_518[7], XLXN_518[8], XLXN_518[9], XLXN_518[10], XLXN_518[11], XLXN_518[12], XLXN_518[13], XLXN_518[14], XLXN_518[15], XLXN_518[16], XLXN_518[17], XLXN_518[18], XLXN_518[19], XLXN_518[20], XLXN_518[21], XLXN_518[22], XLXN_518[23], XLXN_518[24], XLXN_518[25], XLXN_518[26], XLXN_518[27]}),
    .leftKeyIn({XLXN_519[0], XLXN_519[1], XLXN_519[2], XLXN_519[3], XLXN_519[4], XLXN_519[5], XLXN_519[6], XLXN_519[7], XLXN_519[8], XLXN_519[9], XLXN_519[10], XLXN_519[11], XLXN_519[12], XLXN_519[13], XLXN_519[14], XLXN_519[15], XLXN_519[16], XLXN_519[17], XLXN_519[18], XLXN_519[19], XLXN_519[20], XLXN_519[21], XLXN_519[22], XLXN_519[23], XLXN_519[24], XLXN_519[25], XLXN_519[26], XLXN_519[27]}),
    .rightIn({XLXN_517[0], XLXN_517[1], XLXN_517[2], XLXN_517[3], XLXN_517[4], XLXN_517[5], XLXN_517[6], XLXN_517[7], XLXN_517[8], XLXN_517[9], XLXN_517[10], XLXN_517[11], XLXN_517[12], XLXN_517[13], XLXN_517[14], XLXN_517[15], XLXN_517[16], XLXN_517[17], XLXN_517[18], XLXN_517[19], XLXN_517[20], XLXN_517[21], XLXN_517[22], XLXN_517[23], XLXN_517[24], XLXN_517[25], XLXN_517[26], XLXN_517[27], XLXN_517[28], XLXN_517[29], XLXN_517[30], XLXN_517[31]}),
    .leftKeyOut({XLXN_580[0], XLXN_580[1], XLXN_580[2], XLXN_580[3], XLXN_580[4], XLXN_580[5], XLXN_580[6], XLXN_580[7], XLXN_580[8], XLXN_580[9], XLXN_580[10], XLXN_580[11], XLXN_580[12], XLXN_580[13], XLXN_580[14], XLXN_580[15], XLXN_580[16], XLXN_580[17], XLXN_580[18], XLXN_580[19], XLXN_580[20], XLXN_580[21], XLXN_580[22], XLXN_580[23], XLXN_580[24], XLXN_580[25], XLXN_580[26], XLXN_580[27]}),
    .rightKeyOut({XLXN_579[0], XLXN_579[1], XLXN_579[2], XLXN_579[3], XLXN_579[4], XLXN_579[5], XLXN_579[6], XLXN_579[7], XLXN_579[8], XLXN_579[9], XLXN_579[10], XLXN_579[11], XLXN_579[12], XLXN_579[13], XLXN_579[14], XLXN_579[15], XLXN_579[16], XLXN_579[17], XLXN_579[18], XLXN_579[19], XLXN_579[20], XLXN_579[21], XLXN_579[22], XLXN_579[23], XLXN_579[24], XLXN_579[25], XLXN_579[26], XLXN_579[27]}),
    .rightOut({XLXN_525[0], XLXN_525[1], XLXN_525[2], XLXN_525[3], XLXN_525[4], XLXN_525[5], XLXN_525[6], XLXN_525[7], XLXN_525[8], XLXN_525[9], XLXN_525[10], XLXN_525[11], XLXN_525[12], XLXN_525[13], XLXN_525[14], XLXN_525[15], XLXN_525[16], XLXN_525[17], XLXN_525[18], XLXN_525[19], XLXN_525[20], XLXN_525[21], XLXN_525[22], XLXN_525[23], XLXN_525[24], XLXN_525[25], XLXN_525[26], XLXN_525[27], XLXN_525[28], XLXN_525[29], XLXN_525[30], XLXN_525[31]}));
  decr_roundRot2 XLXI_239 (
    .leftIn({XLXN_511[0], XLXN_511[1], XLXN_511[2], XLXN_511[3], XLXN_511[4], XLXN_511[5], XLXN_511[6], XLXN_511[7], XLXN_511[8], XLXN_511[9], XLXN_511[10], XLXN_511[11], XLXN_511[12], XLXN_511[13], XLXN_511[14], XLXN_511[15], XLXN_511[16], XLXN_511[17], XLXN_511[18], XLXN_511[19], XLXN_511[20], XLXN_511[21], XLXN_511[22], XLXN_511[23], XLXN_511[24], XLXN_511[25], XLXN_511[26], XLXN_511[27], XLXN_511[28], XLXN_511[29], XLXN_511[30], XLXN_511[31]}),
    .rightKeyIn({XLXN_515[0], XLXN_515[1], XLXN_515[2], XLXN_515[3], XLXN_515[4], XLXN_515[5], XLXN_515[6], XLXN_515[7], XLXN_515[8], XLXN_515[9], XLXN_515[10], XLXN_515[11], XLXN_515[12], XLXN_515[13], XLXN_515[14], XLXN_515[15], XLXN_515[16], XLXN_515[17], XLXN_515[18], XLXN_515[19], XLXN_515[20], XLXN_515[21], XLXN_515[22], XLXN_515[23], XLXN_515[24], XLXN_515[25], XLXN_515[26], XLXN_515[27]}),
    .leftKeyIn({XLXN_516[0], XLXN_516[1], XLXN_516[2], XLXN_516[3], XLXN_516[4], XLXN_516[5], XLXN_516[6], XLXN_516[7], XLXN_516[8], XLXN_516[9], XLXN_516[10], XLXN_516[11], XLXN_516[12], XLXN_516[13], XLXN_516[14], XLXN_516[15], XLXN_516[16], XLXN_516[17], XLXN_516[18], XLXN_516[19], XLXN_516[20], XLXN_516[21], XLXN_516[22], XLXN_516[23], XLXN_516[24], XLXN_516[25], XLXN_516[26], XLXN_516[27]}),
    .rightIn({XLXN_514[0], XLXN_514[1], XLXN_514[2], XLXN_514[3], XLXN_514[4], XLXN_514[5], XLXN_514[6], XLXN_514[7], XLXN_514[8], XLXN_514[9], XLXN_514[10], XLXN_514[11], XLXN_514[12], XLXN_514[13], XLXN_514[14], XLXN_514[15], XLXN_514[16], XLXN_514[17], XLXN_514[18], XLXN_514[19], XLXN_514[20], XLXN_514[21], XLXN_514[22], XLXN_514[23], XLXN_514[24], XLXN_514[25], XLXN_514[26], XLXN_514[27], XLXN_514[28], XLXN_514[29], XLXN_514[30], XLXN_514[31]}),
    .leftKeyOut({XLXN_519[0], XLXN_519[1], XLXN_519[2], XLXN_519[3], XLXN_519[4], XLXN_519[5], XLXN_519[6], XLXN_519[7], XLXN_519[8], XLXN_519[9], XLXN_519[10], XLXN_519[11], XLXN_519[12], XLXN_519[13], XLXN_519[14], XLXN_519[15], XLXN_519[16], XLXN_519[17], XLXN_519[18], XLXN_519[19], XLXN_519[20], XLXN_519[21], XLXN_519[22], XLXN_519[23], XLXN_519[24], XLXN_519[25], XLXN_519[26], XLXN_519[27]}),
    .rightKeyOut({XLXN_518[0], XLXN_518[1], XLXN_518[2], XLXN_518[3], XLXN_518[4], XLXN_518[5], XLXN_518[6], XLXN_518[7], XLXN_518[8], XLXN_518[9], XLXN_518[10], XLXN_518[11], XLXN_518[12], XLXN_518[13], XLXN_518[14], XLXN_518[15], XLXN_518[16], XLXN_518[17], XLXN_518[18], XLXN_518[19], XLXN_518[20], XLXN_518[21], XLXN_518[22], XLXN_518[23], XLXN_518[24], XLXN_518[25], XLXN_518[26], XLXN_518[27]}),
    .rightOut({XLXN_517[0], XLXN_517[1], XLXN_517[2], XLXN_517[3], XLXN_517[4], XLXN_517[5], XLXN_517[6], XLXN_517[7], XLXN_517[8], XLXN_517[9], XLXN_517[10], XLXN_517[11], XLXN_517[12], XLXN_517[13], XLXN_517[14], XLXN_517[15], XLXN_517[16], XLXN_517[17], XLXN_517[18], XLXN_517[19], XLXN_517[20], XLXN_517[21], XLXN_517[22], XLXN_517[23], XLXN_517[24], XLXN_517[25], XLXN_517[26], XLXN_517[27], XLXN_517[28], XLXN_517[29], XLXN_517[30], XLXN_517[31]}));
